# Altium schematic sheet Esquemático.SchDoc
size A4; SheetNumber: 1; SheetTotal: 1
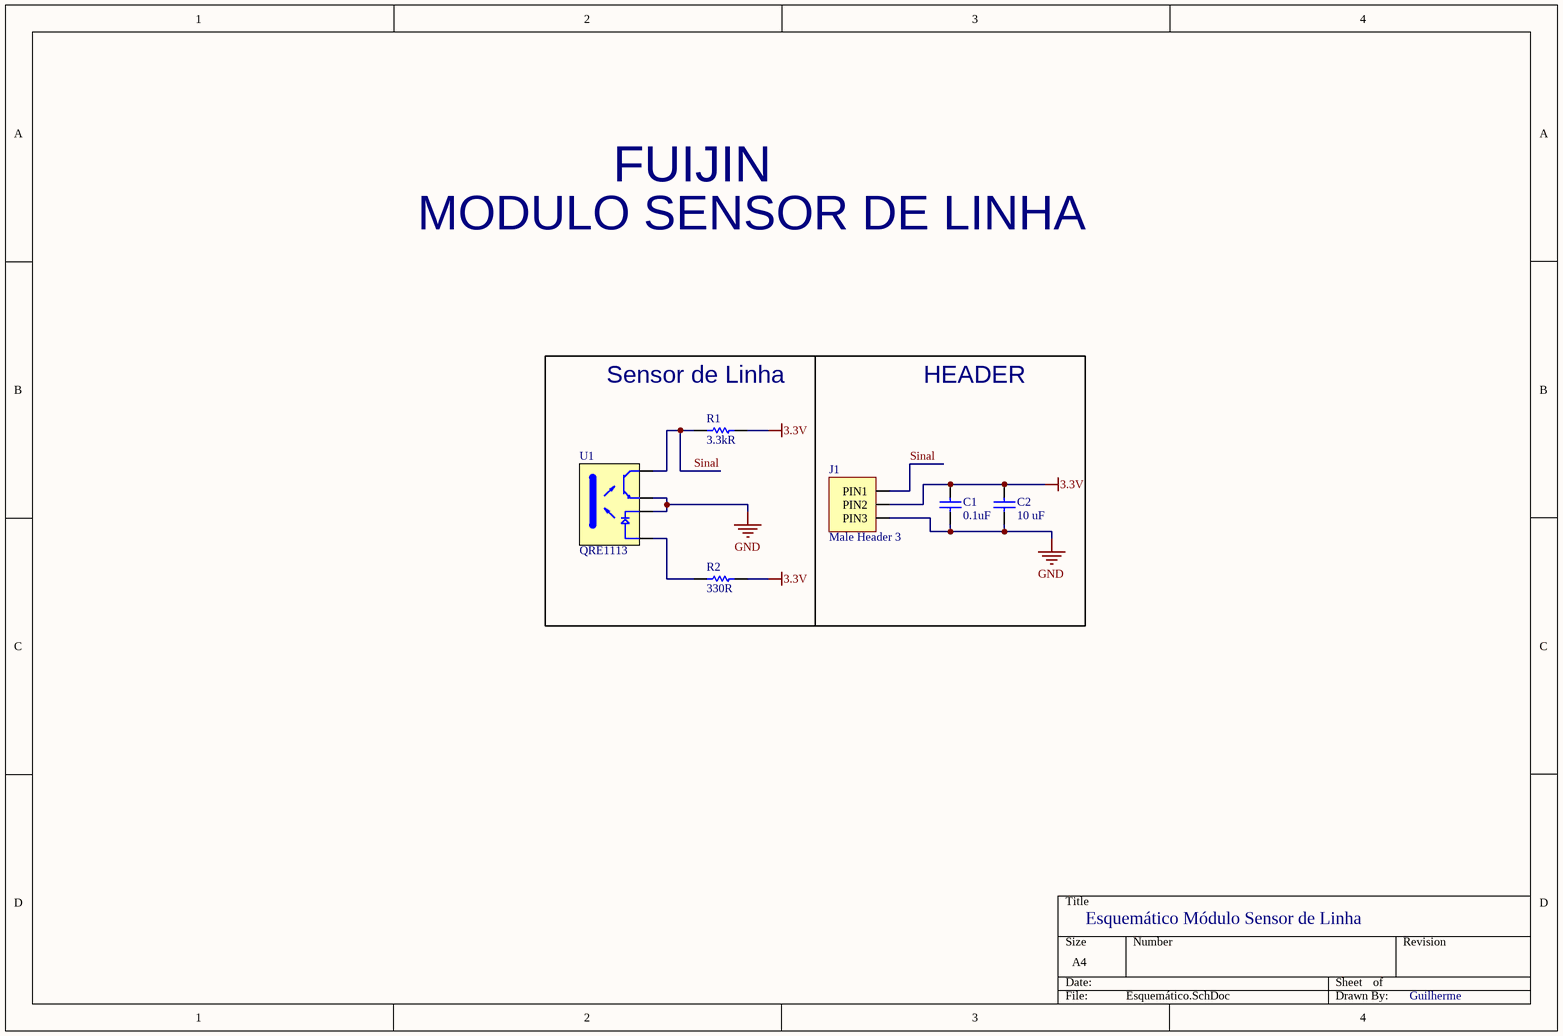
[diagram p0: Esquemático.SchDoc]

## Parts
C1  0.1uF  [CAPC1005X55N]
C2  10 uF  [C0603]
J1  Male Header 3  [MALE HEADER 3]
R1  3.3kR  [RESISTOR_0603]
R2  330R  [RESISTOR_0603]
U1  QRE1113  [QRE1113]

## Blocks framed on the sheet
Sensor de Linha: R1 R2 U1
HEADER: C1 C2 J1

## Nets
3.3V: C1.2 C2.2 J1.PIN2 R1.2 R2.2
GND: C1.1 C2.1 J1.PIN3 U1.C U1.ET
Sinal: J1.PIN1 R1.1 U1.CT
NetR2_1: R2.1 U1.A

## Notes on the sheet
- MODULO SENSOR DE LINHA
- FUIJIN
- Esquemático Módulo Sensor de Linha
- Guilherme

## Library data of the parts
C1 = GRM155R61C104KA88D: CAP CER 0.1uF 16V X5R 0402; Manufacturer: Murata; Tolerance: 10%; Library Control - Checked Footprint: Yes; Library Control - Person that Checked Footprint: Guilherme; Supplier 1: Mouser; Part Number: GRM155R61C104KA88D; Category: Ceramic Capacitors; Price: 1 = 0,10, 10=0,024, 100=0,011 (USD); Supplier Part Number 1: 81-GRM155R61C104KA8D; Library Ref: Capacitor; Operating Temperature: -55°C ~ 85°C; Package / Case: 0402 (1005 Metric); Size / Dimension: 1,0 L x 0,5 W x 0,5 H; Value: 0.1uF; Voltage - Rated: 16V; ESR: -; Dieletric: X5R; Library Control - Checked Schematic: Yes; Library Control - Last Update: 24/07/2021 11:05; Library Control - Person that Checked Schematic: Guilherme; Library Control - Person that did the Last Update Footprint: Guilherme; Library Control - Person that did the Last Update Schematic: Guilherme; ComponentLink1Description: Datasheet; ComponentLink1URL: https://br.mouser.com/datasheet/2/281/1/GRM155R61C104KA88_01A-1983743.pdf; ComponentLink2Description: Mouser Link; ComponentLink2URL: https://br.mouser.com/ProductDetail/Murata-Electronics/GRM155R61C104KA88D?qs=%2Fha2pyFadugsr51Fgcs3VGJIvx6dQb2fpcJyrxDKYTBEoW5q5paGTQ%3D%3D
C2 = GRM188R61C106MA73D: CAP CER 10uF 16V X5R 0603; Manufacturer: MURATA ELECTRONICS; Tolerance: 20%; Voltage - Rated: 16 VDC; Library Control - Checked Schematic: Guilherme; Library Control - Person that did the Last Update Footprint: Raquel; Library Control - Person that did the Last Update Schematic: Marcos; Supplier 1: Mouser; Part Number: GRM188R61C106MA73D; Category: Ceramic capacitor; Price: 1=0,28 10=0,196 100=0,111 1000=0,076 (USD); Supplier Part Number 1: 81-GRM188R61C106MA3D; Library Ref: Capacitor; Operating Temperature: -55°C ~ 85ºC; Package / Case: 0603(1608 metric); Size / Dimension: 1.6 mm L x 0.8 mm W x 0.8 mm H; Value: 10 uF; ESR: -; Dieletric: X5R; Library Control - Last Update: 27/06/2021 15:54; Library Control - Person that Checked Schematic: Guilherme; ComponentLink1Description: Datasheet; ComponentLink1URL: https://br.mouser.com/datasheet/2/281/1/GRM188R61C106MA73_01A-1985803.pdf; ComponentLink2Description: Mouser Link; ComponentLink2URL: https://br.mouser.com/ProductDetail/Murata-Electronics/GRM188R61C106MA73D?qs=OXzh9Ga2KBH8Bmnena8%252BFw%3D%3D
J1 = Male Header 3: Number of Contacts: 3; Library Control - Person that did the Last Update Schematic: Guilherme; System: Connector; Library Ref: Header; Library Control - Checked Footprint: *; Library Control - Checked Schematic: *; Library Control - Last Project that Used: *; Library Control - Last Update: *; Library Control - Person that Checked Footprint: *; Library Control - Person that Checked Schematic: *; Library Control - Persont that did the Last Update Footprint: Guilherme
R1 = CRGCQ0603F3K3: RES SMD 3.3K OHM 1% 1/10W 0603; Manufacturer: TE Connectivity / Holsworthy; Temperature Coefficient: 100 PPM / C; Power Rating: 100 mW (1/10 W); Voltage Rating: 75 V; Library Control - Checked Footprint: Yes; Library Control - Person that Checked Footprint: Nikaum; Library Control - Person that Checked Schematic: Guilherme; Library Control - Person that did the Last Update Footprint: Dalarme; Supplier 1: Mouser; Part Number: CRGCQ0603F3K3; Category: Thick Film Resistors; Price: 1=0,10, 10=0,029, 100=0,011 (USD); Package / Case: 0603 (1608 Metric); Operating Temperature: - 55ºC ~ 125ºC; Value: 3.3kR; Tolerance: 1 %; Library Ref: Resistor; Resistor Type: Fixed; Size / Dimension: 1.6 mm L x  0.8 mm W x  0.45 mm H; Supplier Part Number 1: 279-CRGCQ0603F3K3; Library Control - Checked Schematic: Yes; Library Control - Last Update: 27/06/2021 20:27; Library Control - Person that did the Last Update Schematic: Dalarme; ComponentLink1Description: Mouser Link; ComponentLink1URL: https://br.mouser.com/ProductDetail/TE-Connectivity-Holsworthy/CRGCQ0603F3K3?qs=sGAEpiMZZMvdGkrng054t7z4BkURc4Lz7mzhBruKq8fwVJ16OlxZFQ%3D%3D; ComponentLink2Description: Datasheet; ComponentLink2URL: https://br.mouser.com/datasheet/2/418/4/NG_DS_1773204-3_1-1358553.pdf
R2 = RC0603JR-07330RL: RES SMD 330 OHM 5% 1/10W 0603; Manufacturer: Yageo; Temperature Coefficient: 100 PPM / C; Power Rating: 100 mW (1/10 W); Voltage Rating: 75 V; Library Control - Checked Footprint: No; Library Control - Checked Schematic: Yes; Library Control - Person that Checked Schematic: Guilherme; Library Control - Person that did the Last Update Footprint: Dalarme; Supplier 1: Mouser; Part Number: RC0603JR-07330RL; Category: Thick Film Resistors - SMD; Price: 1=0,10, 10=0,015, 100=0,005 (USD); Package / Case: 0603 (1806 Metric); Operating Temperature: - 55ºC ~ 155ºC; Value: 330R; Tolerance: 5 %; Library Ref: Resistor; Resistor Type: Fixed; Size / Dimension: 1.6 mm L x  0.8 mm W x  0.45 mm H; Supplier Part Number 1: 603-RC0603JR-07330RL; Library Control - Last Update: 26/06/21 14:47; Library Control - Person that did the Last Update Schematic: Dalarme; ComponentLink1Description: Mouser Link; ComponentLink1URL: https://br.mouser.com/ProductDetail/Yageo/RC0603JR-07330RL?qs=P6JsaOY39iiskIKe5bFlJA%3D%3D; ComponentLink2Description: Datasheet; ComponentLink2URL: https://br.mouser.com/datasheet/2/447/Yageo_03_18_2021_PYu_RC_Group_51_RoHS_L_11-2199992.pdf
U1 = QRE1113: PHOTOTRANSISTORQRE1113 - 1CH - Tube; Manufacturer: ON Semiconductor; Sensing Distance: 1 mm; Collector - Emitter Voltage VCEO Max: 30 V; Maximum Collector Current: 20 mA; Sensing Method: Reflective; Power Dissipation: 75 mW; Vf - Forward Voltage: 1,2 V; Vr - Reverse Voltage: 5 V; Library Control - Checked Footprint: Yes; Library Control - Person that Checked Footprint: Nikaum; Fall time: 20 us; Number of Channels: 1; ComponentLink1Description: Datasheet; ComponentLink1URL: https://www.mouser.com/datasheet/2/308/1/QRE1113_D-2319742.pdf; ComponentLink2Description: Mouser Link; ComponentLink2URL: https://www.mouser.com/ProductDetail/ON-Semiconductor-Fairchild/QRE1113GR?qs=Qb0BA3xILekkPpSVC5x7uQ%3D%3D; Part Number: QRE1113; Price: 1=1.36, 10=1.13, 100=0.639 (USD); Mounting Style: Through Hole; Output Type: Phototransistor; Operating Temperature (Min - Máx): -40~85 °C; Supplier 1: Mouser; Library Ref: Diversos; Library Control - Checked Schematic: Yes; Library Control - Last Update: 15/06/2021; Library Control - Person that Checked Schematic: Nikaum; Library Control - Person that did the Last Update in Footprint: Nikaum; Library Control - Person that did the Last Update in Schematic: Nikaum; Packaging: Tube; If - Forward Current: 20 mA